# Altium schematic sheet P4.SchDoc
size A
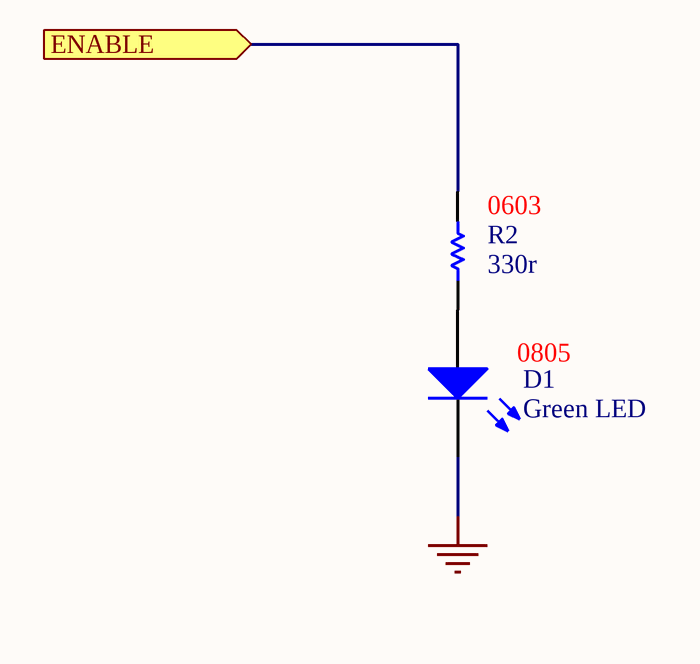
[diagram p0: P4.SchDoc]

## Parts
D1  Green LED  [LED 0805N]
R2  value 330r  [RESC1608N]  (hidden comment: Res1)

## Ports
ENABLE (in)

## Nets
GND: D1.2(K)
ENABLE: R2.2 ; port ENABLE
NetD1_1: D1.1(A) R2.1

## Notes on the sheet
- (near R2) 0603
- 0805

## Library data of the parts
D1 = LED0: Typical INFRARED GaAs LED; Reference_fabricant: KPT-2012SGC; Fabricant: KINGBRIGHT; Reference_fournisseur: 2099239; Fournisseur: Farnell; Published: 8-Jun-2000; LatestRevisionDate: 08-Jul-2005; LatestRevisionNote: Mech Layer 1 removed.; PackageReference: LED-0; Publisher: Altium Limited; PackageDescription: LED; 2 Leads
R2 = Res1: Resistor; Published: 8-Jun-2000; LatestRevisionDate: 17-Jul-2002; LatestRevisionNote: Re-released for DXP Platform.; PackageReference: AXIAL-0.3; Publisher: Altium Limited; PackageDescription: Axial Device, Thru-Hole; 2 Leads; 0.3 in Pin Spacing